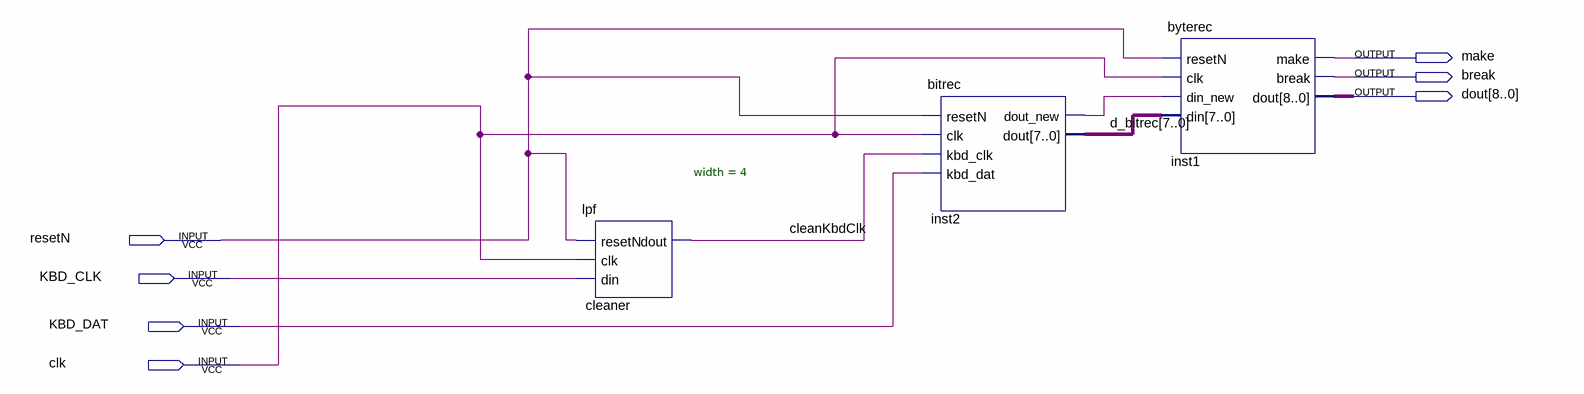
[diagram p0: schematic sheet]
// Quartus schematic KBD.bdf as structural Verilog: 3 symbols, 7 pins
module KBD (
  input  resetN,
  input  KBD_CLK,
  input  KBD_DAT,
  input  clk,
  output make,
  output \break ,
  output [8:0] dout
);

  wire cleanKbdClk, inst2_dout_new;
  wire [7:0] d_bitrec;

  lpf #(.width(4)) cleaner (.resetN(resetN), .clk(clk), .din(KBD_CLK), .dout(cleanKbdClk));
  bitrec inst2 (
    .resetN(resetN), .clk(clk), .kbd_clk(cleanKbdClk), .kbd_dat(KBD_DAT), .dout_new(inst2_dout_new),
    .dout(d_bitrec));
  byterec inst1 (
    .resetN(resetN), .clk(clk), .din_new(inst2_dout_new), .din(d_bitrec), .make(make), .\break (\break ),
    .dout(dout));
endmodule
